# EAGLE design hexaled (EAGLE 5.06)
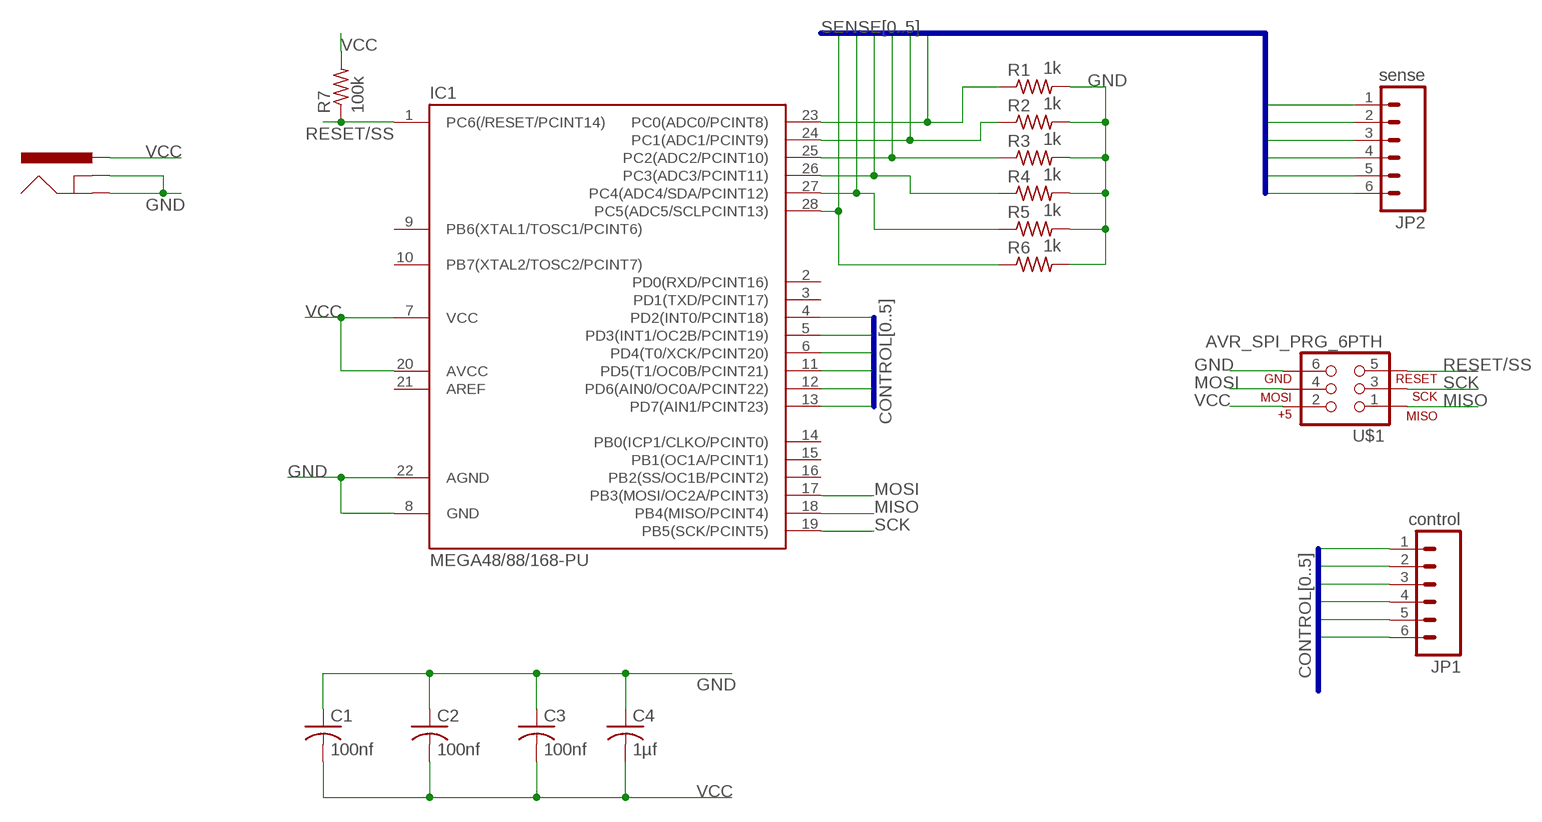
[diagram p0: schematic, sheet 1]

## Parts
C1  100nf  C-US025-030X050  [C025-030X050]
C2  100nf  C-US025-030X050  [C025-030X050]
C3  100nf  C-US025-030X050  [C025-030X050]
C4  1µf  C-US025-030X050  [C025-030X050]
IC1  MEGA48/88/168-PU  [DIL28-3]
J1  POWER_JACKPTH  [POWER_JACK_PTH]
JP1  control  M06POL  [MOLEX-1X6]
JP2  sense  M06POL  [MOLEX-1X6]
R1  1k  R-US_0207/15  [0207/15]
R2  1k  R-US_0207/15  [0207/15]
R3  1k  R-US_0207/15  [0207/15]
R4  1k  R-US_0207/15  [0207/15]
R5  1k  R-US_0207/15  [0207/15]
R6  1k  R-US_0207/15  [0207/15]
R7  100k  R-US_0204/7  [0204/7]
U$1  AVR_SPI_PRG_6PTH  [2X3]

## Nets
CONTROL0: IC1.4(PD2(INT0/PCINT18)) JP1.1
CONTROL1: IC1.5(PD3(INT1/OC2B/PCINT19)) JP1.2
CONTROL2: IC1.6(PD4(T0/XCK/PCINT20)) JP1.3
CONTROL3: IC1.11(PD5(T1/OC0B/PCINT21)) JP1.4
CONTROL4: IC1.12(PD6(AIN0/OC0A/PCINT22)) JP1.5
CONTROL5: IC1.13(PD7(AIN1/PCINT23)) JP1.6
GND [power]: C1.1 C2.1 C3.1 C4.1 IC1.8(GND) IC1.22(AGND) J1.GND J1.GNDBREAK R1.2 R2.2 R3.2 R4.2 R5.2 R6.2 U$1.6
MISO: IC1.18(PB4(MISO/PCINT4)) U$1.1
MOSI: IC1.17(PB3(MOSI/OC2A/PCINT3)) U$1.4
RESET/SS: IC1.1(PC6(/RESET/PCINT14)) R7.1 U$1.5
SCK: IC1.19(PB5(SCK/PCINT5)) U$1.3
SENSE0: IC1.23(PC0(ADC0/PCINT8)) JP2.1 R1.1
SENSE1: IC1.24(PC1(ADC1/PCINT9)) JP2.2 R2.1
SENSE2: IC1.25(PC2(ADC2/PCINT10)) JP2.3 R3.1
SENSE3: IC1.26(PC3(ADC3/PCINT11)) JP2.4 R4.1
SENSE4: IC1.27(PC4(ADC4/SDA/PCINT12)) JP2.5 R5.1
SENSE5: IC1.28(PC5(ADC5/SCLPCINT13)) JP2.6 R6.1
VCC [power]: C1.2 C2.2 C3.2 C4.2 IC1.7(VCC) IC1.20(AVCC) J1.PWR R7.2 U$1.2
Unconnected: IC1.2(PD0(RXD/PCINT16)) IC1.3(PD1(TXD/PCINT17)) IC1.9(PB6(XTAL1/TOSC1/PCINT6)) IC1.10(PB7(XTAL2/TOSC2/PCINT7)) IC1.14(PB0(ICP1/CLKO/PCINT0)) IC1.15(PB1(OC1A/PCINT1)) IC1.16(PB2(SS/OC1B/PCINT2)) IC1.21(AREF)

## Buses
CONTROL[0..5]
SENSE[0..5]

## Library data of the parts
C1-C4 = rcl:C-US: CAPACITOR, American symbol
IC1 = avr-6:MEGA48/88/168-PU
J1 = SparkFun.1:POWER_JACK: Power Jack This is the standard 5.5mm barrel jack for power. The PTH is the most common, proven, reliable, footprint. All others are experimental. The Slot footprint only works if the mill layer is transmitted to the PCB fab house so be warned. Spark Fun Electronics SKU : PRT-00119. Mating wall wart : TOL-00298 (and others)
JP1 JP2 = SparkFun.1:M06: Header 6 Standard 6-pin 0.1" header. Use with straight break away headers (SKU : PRT-00116), right angle break away headers (PRT-00553), swiss pins (PRT-00743), machine pins (PRT-00117), and female headers (PRT-00115). Molex polarized connector foot print use with SKU : PRT-08094 with associated crimp pins and housings.
R1-R7 = rcl:R-US_: RESISTOR, American symbol
U$1 = SparkFun.1:AVR_SPI_PRG_6: AVR ISP 6 Pin This is the reduced ISP connector for AVR programming. Common on Arduino. This footprint will take up less PCB space and can be used with a 10-pin to 6-pin adapter such as SKU: BOB-08508

## Net classes
1 power: width 0.406 mm, clearance 0.203 mm

## Board
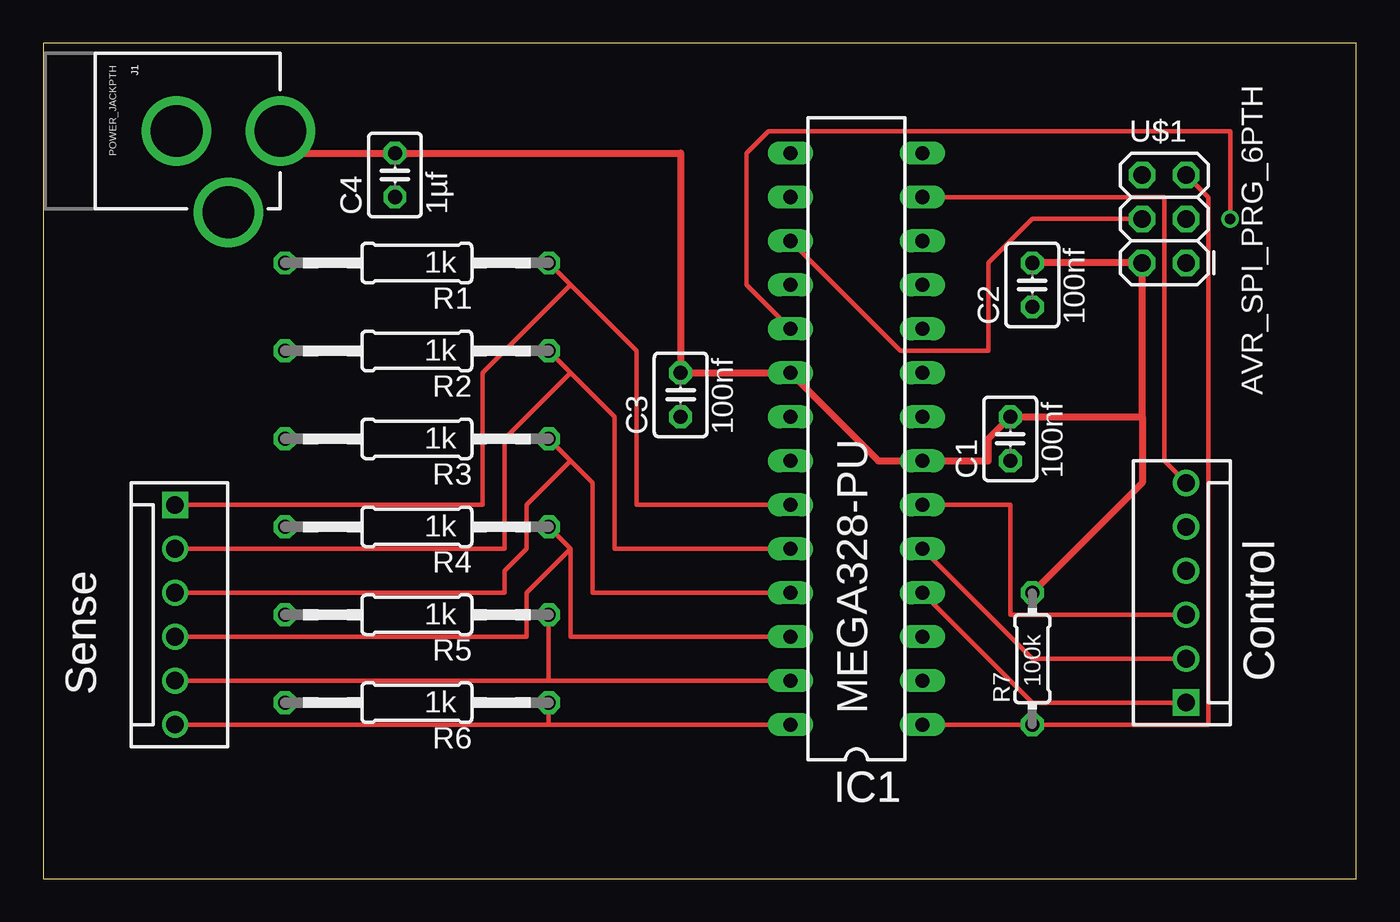
[diagram p1: board, top side]
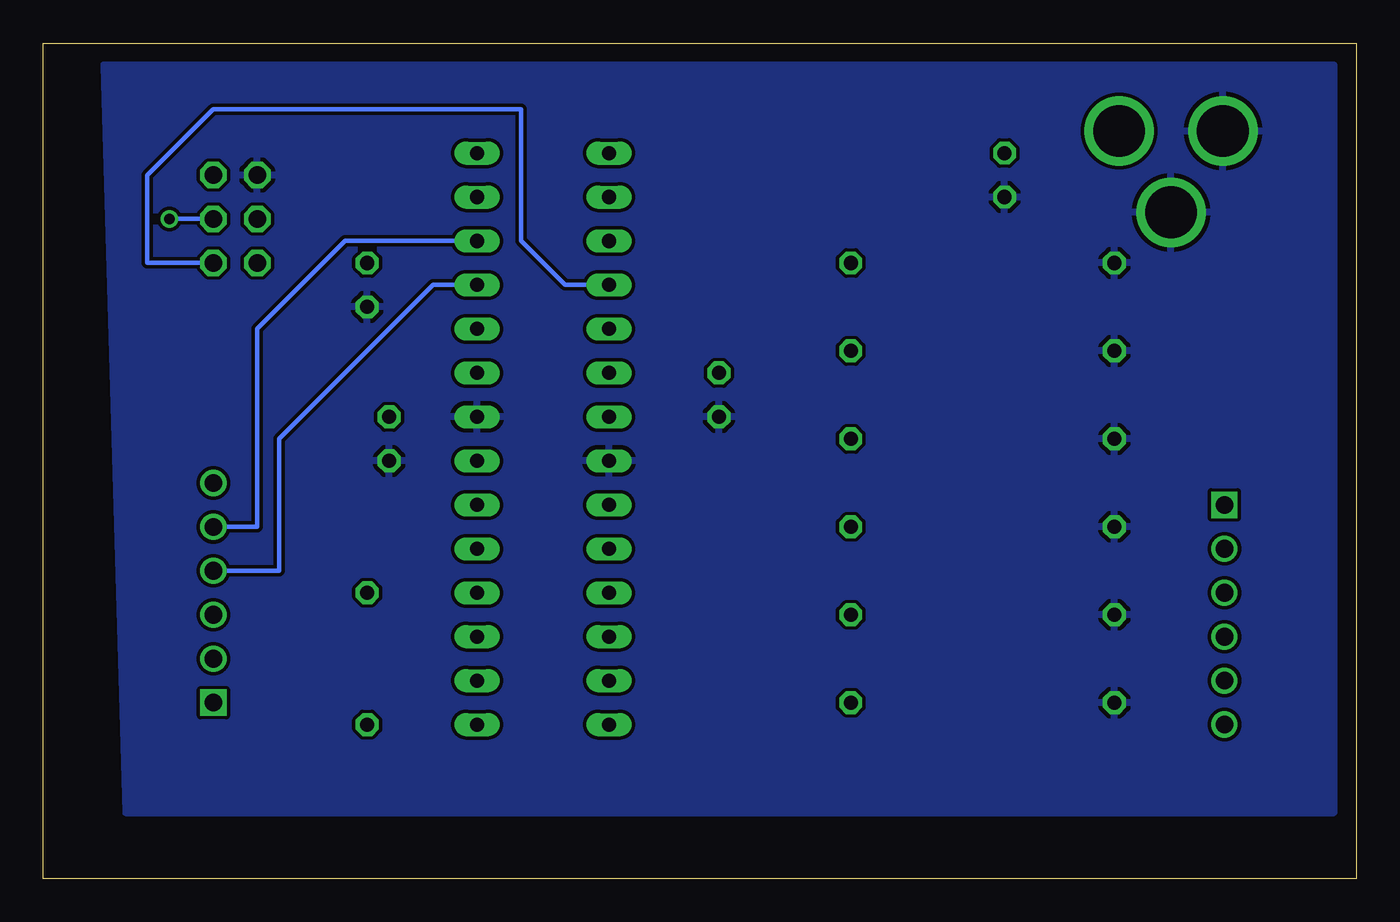
[diagram p2: board, bottom side, seen from below]

Size 75.87 x 48.25 mm. Coordinates in mm from the lower left corner, seen from the top.
Outline: 0,0 75.87,0 75.87,48.25 0,48.25 0,0
Copper layers (1*16): Top 0.035mm / dielectric 1.5mm / Bottom 0.035mm
Design rules "default": minimum track width 10mil, minimum drill 24mil, track to track 8mil, track to pad 8mil, pad to pad 8mil, via to via 8mil, smd to smd 8mil, copper to edge 40mil, drill to drill 8mil, minimum pad ring 10mil, minimum via ring 8mil, stop-mask expansion 4mil, vias tented up to drill 0mil, thermal gap 10mil

### Footprints (pad centres in the part's own frame; a part is rotated, then mirrored left to right if it is on the bottom)
C025-030X050 = drill 0.813 octagon: 1 -1.27,0; 2 1.27,0
DIL28-3 = drill 0.813 long: 1 -16.51,-3.81; 2 -13.97,-3.81; 3 -11.43,-3.81; 4 -8.89,-3.81; 5 -6.35,-3.81; 6 -3.81,-3.81; 7 -1.27,-3.81; 8 1.27,-3.81; 9 3.81,-3.81; 10 6.35,-3.81; 11 8.89,-3.81; 12 11.43,-3.81; 13 13.97,-3.81; 14 16.51,-3.81; 15 16.51,3.81; 16 13.97,3.81; 17 11.43,3.81; 18 8.89,3.81; 19 6.35,3.81; 20 3.81,3.81; 21 1.27,3.81; 22 -1.27,3.81; 23 -3.81,3.81; 24 -6.35,3.81; 25 -8.89,3.81; 26 -11.43,3.81; 27 -13.97,3.81; 28 -16.51,3.81
POWER_JACK_PTH = drill 2.997 round: GND 0,7.7; GNDBREAK 4.7,10.7; PWR 0,13.7
MOLEX-1X6 = drill 1.016 square: 1 0,0 | drill 1.016 round: 2 2.54,0; 3 5.08,0; 4 7.62,0; 5 10.16,0; 6 12.7,0
0207/15 = drill 0.813 octagon: 1 -7.62,0; 2 7.62,0
0204/7 = drill 0.813 octagon: 1 -3.81,0; 2 3.81,0
2X3 = drill 1.016 octagon: 1 0,0; 2 0,2.54; 3 2.54,0; 4 2.54,2.54; 5 5.08,0; 6 5.08,2.54

### Placement (x,y rotation side)
C1  55.88,25.4 90 top
C2  57.15,34.29 90 top
C3  36.83,27.94 90 top
C4  20.32,40.64 90 top
IC1  MEGA328-PU  [DIL28-3]  46.99,25.4 90 top
J1  0,43.18 270 top
JP1  66.04,10.16 90 top
JP2  7.62,21.59 270 top
R1  21.59,35.56 180 top
R2  21.59,30.48 180 top
R3  21.59,25.4 180 top
R4  21.59,20.32 180 top
R5  21.59,15.24 180 top
R6  21.59,10.16 180 top
R7  57.15,12.7 90 top
U$1  66.04,35.56 90 top

### Tracks (layer width: path | path; a pad name or v marks a point on that pad's centre or on a via)
CONTROL0
  Top 0.254: IC1.4 57.15,10.16 JP1.1
CONTROL1
  Top 0.254: IC1.5 57.15,12.7 JP1.2
CONTROL2
  Top 0.254: IC1.6 55.88,21.59 55.88,15.24 JP1.3
CONTROL3
  Bottom 0.254: IC1.11 53.34,34.29 62.23,25.4 62.23,17.78 JP1.4
CONTROL4
  Bottom 0.254: IC1.12 58.42,36.83 63.5,31.75 63.5,20.32 JP1.5
CONTROL5
  Top 0.254: IC1.13 64.77,39.37 64.77,24.13 JP1.6
GND
  pour Bottom: 1.27,46.99 72.39,46.99 71.12,3.81 1.27,3.81
MISO
  Bottom 0.254: IC1.18 45.72,34.29 48.26,36.83 48.26,44.45 66.04,44.45 69.85,40.64 69.85,35.56 U$1.1
MOSI
  Top 0.254: IC1.17 49.53,30.48 54.61,30.48 54.61,35.56 57.15,38.1 U$1.4
RESET/SS
  Top 0.254: IC1.1 R7.1 67.31,8.89 67.31,39.37 U$1.5
SCK  (via drill 0.61)
  Top 0.254: IC1.19 40.64,34.29 40.64,41.91 41.91,43.18 68.58,43.18 v68.58,38.1
  Bottom 0.254: v68.58,38.1 U$1.3
SENSE0
  Top 0.254: IC1.23 34.29,21.59 34.29,30.48 30.48,34.29 | 30.48,34.29 R1.1 | JP2.1 25.4,21.59 25.4,29.21 30.48,34.29
SENSE1
  Top 0.254: IC1.24 33.02,19.05 33.02,26.67 30.48,29.21 | 30.48,29.21 R2.1 | JP2.2 26.67,19.05 26.67,25.4 30.48,29.21
SENSE2
  Top 0.254: IC1.25 31.75,16.51 31.75,22.86 30.48,24.13 | 30.48,24.13 R3.1 | JP2.3 26.67,16.51 26.67,17.78 27.94,19.05 27.94,21.59 30.48,24.13
SENSE3
  Top 0.254: IC1.26 30.48,13.97 30.48,19.05 | 30.48,19.05 R4.1 | JP2.4 27.94,13.97 27.94,16.51 30.48,19.05
SENSE4
  Top 0.254: 29.21,11.43 IC1.27 | 29.21,11.43 R5.1 | JP2.5 29.21,11.43
SENSE5
  Top 0.254: 29.21,8.89 IC1.28 | 29.21,8.89 R6.1 | JP2.6 29.21,8.89
VCC
  Top 0.406: R7.2 63.5,22.86 63.5,26.67 | 63.5,26.67 U$1.2 C2.2 | J1.PWR 13.97,43.18 13.97,41.91 C4.2 36.83,41.91 C3.2 IC1.20 48.26,24.13 IC1.7 54.61,24.13 54.61,25.4 C1.2 63.5,26.67

### Text on the board
tNames: Sense | Control
_tsilk: POWER_JACKPTH | J1 | U$1 | C4 | 1µf | 1k | R1 | C2 | 100nf | 1k | R2 | AVR_SPI_PRG_6PTH | 1k | C3 | 100nf | R3 | C1 | 100nf | 1k | R4 | Sense | 1k | R5 | 1k | 100k | Control | MEGA328-PU | R7 | R6 | IC1